# Altium project ECG.PrjPcb
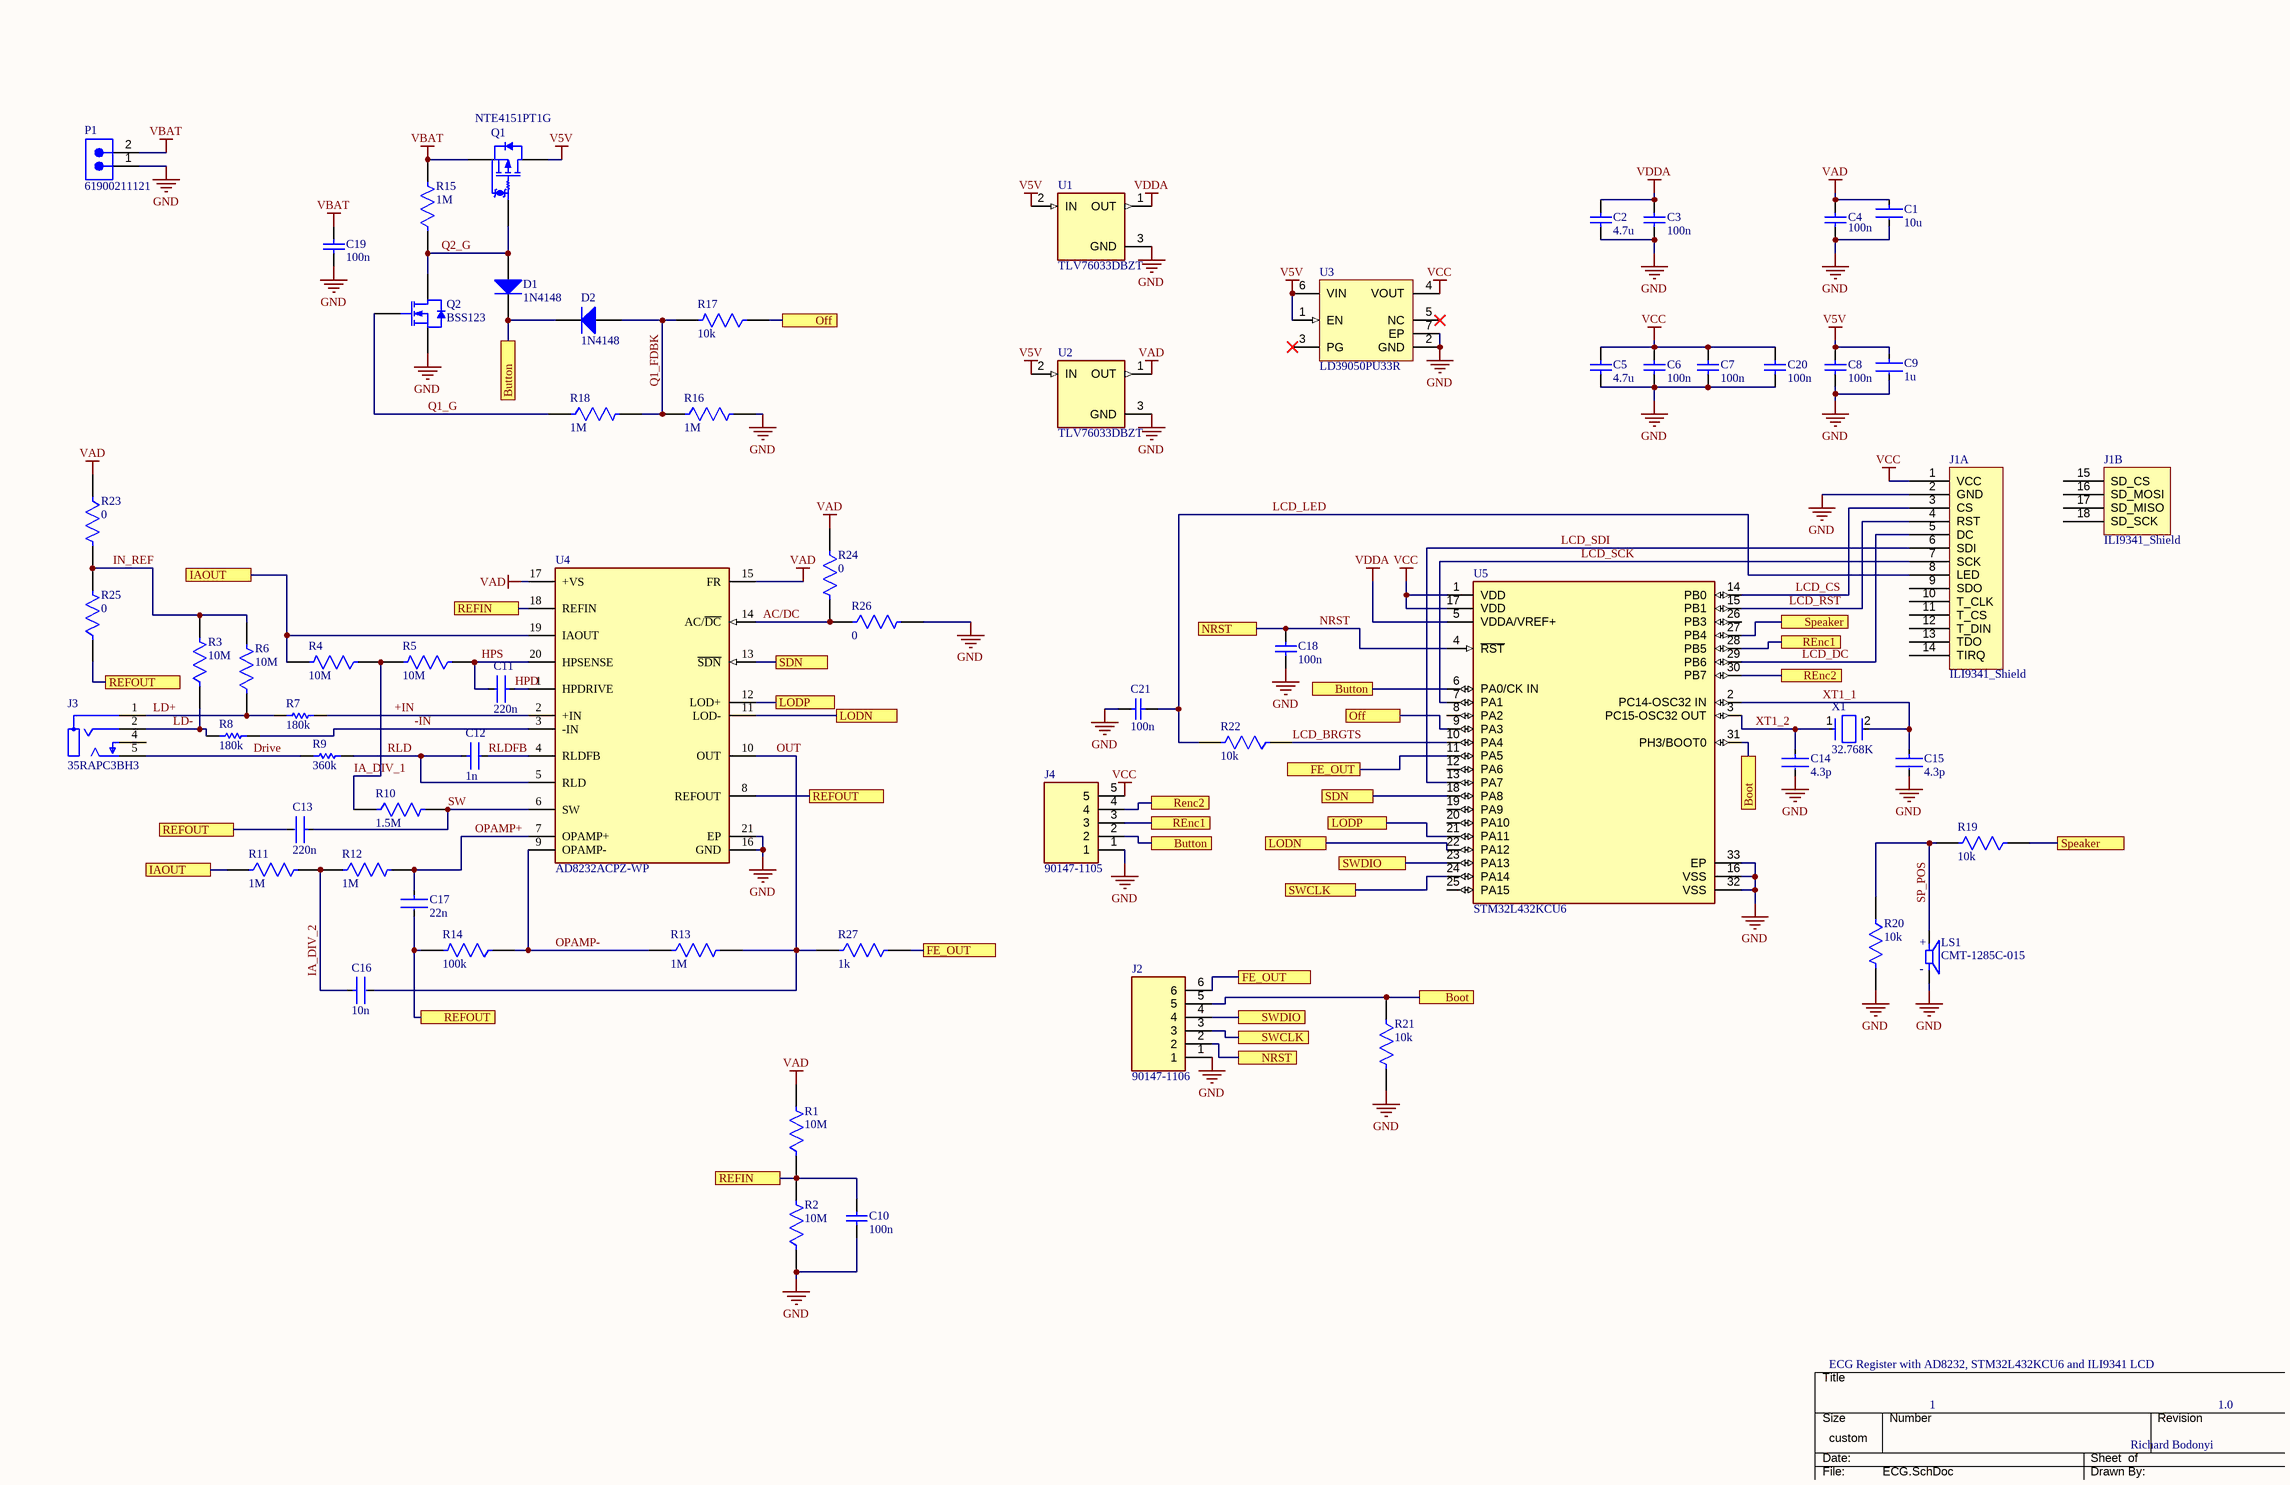
[diagram p0: ECG.SchDoc]
CAGE_CODE: ?????; CONTRACT_NUMBER: <CONTRACT NO>; DOC_NO_ASSY_DWG: <ASSY DWG NO>; DOC_NO_BOM: <BOM DOC NO>; DOC_NO_FAB_DWG: <FAB DWG NO>; DOC_NO_SCH_DWG: <SCH DWG NO>; PCB_2_DEC_TOL: +/-.01; PCB_3_DEC_TOL: +/-.010; PCB_ANG_TOL: +/-1/2; PCB_ASSEMBLY_NO: <PCB ASSY NO>; PCB_CHECKER: - -----; PCB_CHECKER_APP_DATE: --/--/----; PCB_DESIGNER: Richard Bodonyi; PCB_DESIGNER_APP_DATE: --/--/----; PCB_DWG_NO: <PCB DWG NO>; PCB_ENGINEER: Richard Bodonyi; PCB_ENGINEER_APP_DATE: --/--/----; PCB_PART_NUMBER: <PCB PN>; PCB_REV: A; SCH_REV: A
1 sheet, 64 parts. Net scope: flat (ports and power ports of the same name join across sheets).
Board file: ECG.PcbDoc

## Sheet ECG.SchDoc: ECG Register with AD8232, STM32L432KCU6 and ILI9341 LCD
size 431 x 279 mm; Date: 21/04/2024; Author: Richard Bodonyi; DrawnBy: Richard Bodonyi; Engineer: Richard Bodonyi; Revision: 1.0; SheetNumber: 1; SheetTotal: 1; Project: ECG Register; ENG_APP_DATE: --/--/--; DSN_APP_DATE: --/--/--; CHK_APP_DATE: --/--/--

### Parts
C1  10u  [FP-1206-L_3_2_0_2-W_1_6_0-IPC_B]
C2  4.7u  [CAPC1206(3216)190_N]
C3  100n  [CAPC1206(3216)100_N]
C4  100n  [CAPC1206(3216)100_N]
C5  4.7u  [CAPC1206(3216)190_N]
C6  100n  [CAPC1206(3216)100_N]
C7  100n  [CAPC1206(3216)100_N]
C8  100n  [CAPC1206(3216)100_N]
C9  1u  [FP-CL31-IPC_B]
C10  100n  [CAPC1206(3216)100_N]
C11  220n  [FP-CL31-IPC_B]
C12  1n  [FP-CL31-IPC_C]
C13  220n  [FP-CL31-IPC_B]
C14  4.3p  [FP-C1206C-EB-MFG]
C15  4.3p  [FP-C1206C-EB-MFG]
C16  10n  [FP-CL31-IPC_B]
C17  22n  [FP-CL31-IPC_B]
C18  100n  [CAPC1206(3216)100_N]
C19  100n  [CAPC1206(3216)100_N]
C20  100n  [CAPC1206(3216)100_N]
C21  100n  [CAPC1206(3216)100_N]
D1  1N4148  [DIOD-SOD123-2_V]
D2  1N4148  [DIOD-SOD123-2_V]
J1  ILI9341_Shield  [ILI9341_Shield-Footprint-1]  (parts A,B of 2)
J2  90147-1106  [RHDR6W64P0X254_1X6_1509X244X870P]
J3  35RAPC3BH3  [FP-35RAPC3BH3-MFG]
J4  90147-1105  [RHDR5W70P0X254_1X5_1255X244X870P]
LS1  CMT-1285C-015  [CUI_CMT-1285C-015]
P1  61900211121  [61900211121]
Q1  NTE4151PT1G  [ONSC-SC-89-3-463C-02_V]
Q2  BSS123  [FAIR-SOT23-3_V]
R1  10M  [FP-KTR18-IPC_B]
R2  10M  [FP-KTR18-IPC_B]
R3  10M  [FP-KTR18-IPC_B]
R4  10M  [FP-KTR18-IPC_B]
R5  10M  [FP-KTR18-IPC_B]
R6  10M  [FP-KTR18-IPC_B]
R7  180k  [RESC3216X70X40NL20T20]
R8  180k  [RESC3216X70X40NL20T20]
R9  360k  [RESC3216X60X45ML10T20]
R10  1.5M  [FP-KTR18-IPC_A]
R11  1M  [FP-KTR18-IPC_C]
R12  1M  [FP-KTR18-IPC_C]
R13  1M  [FP-KTR18-IPC_C]
R14  100k  [FP-KTR18-IPC_A]
R15  1M  [FP-KTR18-IPC_C]
R16  1M  [FP-KTR18-IPC_C]
R17  10k  [FP-CRCW1206-e3-IPC_C]
R18  1M  [FP-KTR18-IPC_C]
R19  10k  [FP-CRCW1206-e3-IPC_C]
R20  10k  [FP-CRCW1206-e3-IPC_C]
R21  10k  [FP-CRCW1206-e3-IPC_C]
R22  10k  [FP-CRCW1206-e3-IPC_C]
R23  0  [FP-CRCW1206-e3-IPC_C]
R24  0  [FP-CRCW1206-e3-IPC_C]
R25  0  [FP-CRCW1206-e3-IPC_C]
R26  0  [FP-CRCW1206-e3-IPC_C]
R27  1k  [FP-CRCW1206-e3-IPC_C]
U1  TLV76033DBZT  [FP-DBZ0003A-MFG]
U2  TLV76033DBZT  [FP-DBZ0003A-MFG]
U3  LD39050PU33R  [DFN6D_L]
U4  AD8232ACPZ-WP  [FP-CP-20-8-IPC_A]
U5  STM32L432KCU6  [FP-UFQFPN32-A0B8-MFG]
X1  32.768K  [FP-NX3215SA-MFG]

### Ports
Boot, Button, FE_OUT, IAOUT, LODN, LODP, NRST, Off, REFIN, REFOUT, REnc1, REnc2, Renc2, SDN, Speaker, SWCLK, SWDIO

### Nets
GND: C1.2 C2.1 C3.1 C4.1 C5.1 C6.1 C7.1 C8.1 C9.2 C10.1 C14.2 C15.2 C18.2 C19.1 C20.2 C21.1 J1.2(GND) J2.1 J4.1 LS1.N P1.1 Q2.2(S) R2.1 R16.2 R20.2 R21.2 R26.2 U1.3(GND) U2.3(GND) U3.2(GND) U3.7(EP) U4.16(GND) U4.21(EP) U5.16(VSS) U5.32(VSS) U5.33(EP)
V5V: C8.2 C9.1 Q1.3(D) U1.2(IN) U2.2(IN) U3.1(EN) U3.6(VIN)
VAD: C1.1 C4.2 R1.2 R23.1 R24.1 U2.1(OUT) U4.15(FR) U4.17(+VS)
VBAT: C19.2 P1.2 Q1.2(S) R15.2
VCC: C5.2 C6.2 C7.2 C20.1 J1.1(VCC) J4.5 U3.4(VOUT) U5.1(VDD) U5.17(VDD)
VDDA: C2.2 C3.2 U1.1(OUT) U5.5(VDDA/VREF+)
+IN: R7.2 U4.2(+IN)
-IN: R8.2 U4.3(-IN)
AC/DC: R24.2 R26.1 U4.14(AC/~{DC})
Boot: J2.5 R21.1 U5.31(PH3/BOOT0) ; port Boot
Button: D1.2(K) D2.2(K) J4.2 U5.6(PA0/CK_IN) ; port Button
Drive: J3.5 R9.1
FE_OUT: J2.6 R27.2 U5.11(PA5) ; port FE_OUT
HPD: C11.1 U4.1(HPDRIVE)
HPS: C11.2 R5.1 U4.20(HPSENSE)
IA_DIV_1: R4.1 R5.2 R10.1
IA_DIV_2: C16.1 R11.2 R12.1
IAOUT: R4.2 R11.1 U4.19(IAOUT) ; port IAOUT
IN_REF: R3.2 R6.2 R23.2 R25.2
LCD_BRGTS: R22.1 U5.10(PA4)
LCD_CS: J1.3(CS) U5.14(PB0)
LCD_DC: J1.5(DC) U5.29(PB6)
LCD_LED: C21.2 J1.8(LED) R22.2
LCD_RST: J1.4(RST) U5.15(PB1)
LCD_SCK: J1.7(SCK) U5.7(PA1)
LCD_SDI: J1.6(SDI) U5.13(PA7)
LD+: J3.1 R6.1 R7.1
LD-: J3.2 R3.1 R8.1
LODN: U4.11(LOD-) U5.22(PA12) ; port LODN
LODP: U4.12(LOD+) U5.21(PA11) ; port LODP
NRST: C18.1 J2.2 U5.4(~{RST}) ; port NRST
Off: R17.1 U5.9(PA3) ; port Off
OPAMP+: C17.1 R12.2 U4.7(OPAMP+)
OPAMP-: R13.1 R14.1 U4.9(OPAMP-)
OUT: C16.2 R13.2 R27.1 U4.10(OUT)
Q1_FDBK: D2.1(A) R16.1 R17.2 R18.2
Q1_G: Q2.1(G) R18.1
Q2_G: D1.1(A) Q1.1(G) Q2.3(D) R15.1
REFIN: C10.2 R1.1 R2.2 U4.18(REFIN) ; port REFIN
REFOUT: C13.2 C17.2 R14.2 R25.1 U4.8(REFOUT) ; port REFOUT
REnc1: J4.3 U5.28(PB5) ; port REnc1
REnc2: J4.4 U5.30(PB7) ; port REnc2, port Renc2
RLD: C12.1 R9.2 U4.5(RLD)
RLDFB: C12.2 U4.4(RLDFB)
SDN: U4.13(~{SDN}) U5.18(PA8) ; port SDN
SP_POS: LS1.P R19.2 R20.1
Speaker: R19.1 U5.27(PB4) ; port Speaker
SW: C13.1 R10.2 U4.6(SW)
SWCLK: J2.3 U5.24(PA14) ; port SWCLK
SWDIO: J2.4 U5.23(PA13) ; port SWDIO
XT1_1: C15.1 U5.2(PC14-OSC32_IN) X1.2
XT1_2: C14.1 U5.3(PC15-OSC32_OUT) X1.1

Not connected (* = marked no-connect by the designer): J1 9(SDO) 10(T_CLK) 11(T_CS) 12(T_DIN) 13(TDO) 14(TIRQ) 15(SD_CS) 16(SD_MOSI) 17(SD_MISO) 18(SD_SCK); J3 4; U3 3(PG)* 5(NC)*; U5 8(PA2) 12(PA6) 19(PA9) 20(PA10) 25(PA15) 26(PB3)

### Notes on the sheet
- 1
- DWG. NO.
- REV.
- SHT.
- THIS DOCUMENT AND THE DATA DISCLOSED HEREIN OR HEREWITH IS THE PROPERTY OF ALTIUM LIMITED AND MAY BE FREELY DISTRIBUTED IN WHOLE. NO RIGHTS ARE RESERVED OR EXPRESS OR IMPLIED WARANTEE GIVEN.
- REVISION
- DESCRIPTION
- DATE
- APPROVED
- ENG:
- APPROVALS
- PROJECT
- DSN:
- CHK:
- REFERENCE DOCUMENTS
- PROJECT REVISION:
- TITLE
- DOCUMENT REVISION:
- DESIGN ITEM:
- BOM:
- FAB DWG:
- PCB DWG:
- ASSY DWG:
- SCALE:
- SIZE
- B
- CAGE CODE
- FILE NAME
- DWG NO.
- SHEET
- OF
- REV
- (in symbol CMT-1285C-015) +; -

### Library data of the parts
C1 = CMP-04427-001599-1: General Purpose Ceramic Capacitor, 1206, 10uF, 20%, X5R, 15%, 50V
C2 C5 = CMP-1037-04896-1: CAP 4.7uF 6.3V ±10% 1206 (3216 Metric) Thickness 1.9mm SMD; Manufacturer Part Number: C1206C475K9PACTU; Case-Metric: 3216; Case-EIA: 1206; Tolerance: Â±10%; Value: 4.7uF; Max Thickness: 1.9 mm; Technology: SMT; Rated Voltage: 6.3 V
C3 C4 C6-C8 C10 C19 = CMP-1037-04190-1: CAP 100nF 25V ±5% 1206 (3216 Metric) Thickness 1mm SMD; Case-EIA: 1206; Tolerance: Â±5%; Case-Metric: 3216; Value: 100nF; Rated Voltage: 25 V; Technology: SMT; Max Thickness: 1 mm
C9 = CMP-13271-003701-1: Cap Ceramic 1uF 16V X7R ±10% SMD 1206 +125°C Embossed T/R; Mount: Surface Mount; Length: 0.126inch; Package Quantity: 1; Packaging: Tape and Reel; Max Operating Temperature: 125°C; Case/Package: 1206; Case Code (Metric): 3216; Tolerance: 10%; Min Operating Temperature: -55°C; Thickness: 0.055inch; Case Code (Imperial): 1206; Voltage Rating: 16V; Width: 0.063inch; Capacitance: 1uF
C11 C13 = CMP-13271-000776-1: Cap Ceramic 220nF 50V X7R ±10% SMD 1206 +125°C Embossed T/R; Length: 0.126inch; Case Code (Imperial): 1206; Package Quantity: 1; Case Code (Metric): 3216; Case/Package: 1206; Radiation Hardening: No; Min Operating Temperature: -55°C; Mount: Surface Mount; Max Operating Temperature: 125°C; Depth: 1.6mm; Tolerance: 10%; Capacitance: 220nF; Thickness: 0.055inch; Height: 1.25mm; Dielectric: X7R; Voltage Rating: 50V; Width: 0.063inch; Packaging: Tape and Reel
C12 = CMP-13271-001948-1: Cap Ceramic 1nF 50V X7R ±10% SMD 1206 +125°C Embossed T/R; Voltage: 63V; Case Code (Imperial): 1206; Depth: 1.6mm; Case Code (Metric): 3216; Width: 0.063inch; Package Quantity: 4000; Height: 0.85mm; Max Operating Temperature: 125°C; Radiation Hardening: No; Thickness: 0.037inch; Tolerance: 10%; Case/Package: 1206; Packaging: Tape and Reel; Voltage Rating (DC): 50V; Min Operating Temperature: -55°C; Material: Ceramic; Capacitance: 1nF; Length: 3.2mm; Voltage Rating: 50V; Mount: Surface Mount; Lead Free: Lead Free; Dielectric: X7R
C14 C15 = CMP-1037-00358-2: CAP CER 4.3PF 50V NP0 1206; Manufacturer: KEMET; Manufacturer Part Number: C1206C439C5GACTU; Tolerance: 0.25 pF; Automotive Grade: Grade 0; Temperature Characteristic: C0G; Material: Ceramic; Temperature Coefficient: 15%; Device Class L3: Ceramic Capacitors; Voltage Rating: 50 V; Capacitance: 4.3 pF; Octopart: https://octopart.com/c1206c439c5gactu-kemet-17002280; Lead Free: Yes; Category: Cap; Digikey Description: CAP CER 4.3PF 50V NP0 1206; Temperature: -55°C to +150°C; Package: C1206C-EB; Device Class L2: Capacitors; Value: 4.3 pF; ComponentLink2Description: Datasheet; Temperature Range Low: -55°C; Automotive: Yes; Mouser Description: Multilayer Ceramic Capacitors MLCC - SMD/SMT 50volts 4.3pF C0G 0.25%; Device Class L1: Passive Components; Temperature Range High: +150°C; Height: 0.88mm; Ipc Land Pattern Name: CAPC320160X78; RoHS: TRUE; ComponentLink2URL: https://content.kemet.com/datasheets/KEM_C1007_X8R_ULTRA_150C_SMD.pdf
C16 = CMP-13271-002682-1: Cap Ceramic 10nF 100V X7R ±5% SMD 1206 +125°C Embossed T/R; Case Code (Imperial): 1206; Case Code (Metric): 3216; Packaging: Tape and Reel; Tolerance: 5%; Length: 0.126inch; Case/Package: 1206; Thickness: 0.037inch; Voltage Rating: 100V; Mount: Surface Mount; Min Operating Temperature: -55°C; Capacitance: 10nF; Max Operating Temperature: 125°C; Width: 0.063inch; Package Quantity: 1
C17 = CMP-13271-001653-1: Cap Ceramic 22nF 630V X7R ±10% SMD 1206 +125°C Embossed T/R; Package Quantity: 1; Tolerance: 10%; Capacitance: 22nF; Min Operating Temperature: -55°C; Width: 0.063inch; Voltage Rating: 630V; Packaging: Tape and Reel; Case Code (Metric): 3216; Case/Package: 1206; Max Operating Temperature: 125°C; Thickness: 0.057inch; Lead Free: Lead Free; Length: 0.126inch; Case Code (Imperial): 1206; Mount: Surface Mount
C18 C20 C21 = CMP-1037-04190-1: CAP 100nF 25V ±5% 1206 (3216 Metric) Thickness 1mm SMD; Manufacturer Part Number: VJ1206Y104JXXCW1BC; Case-EIA: 1206; Tolerance: Â±5%; Case-Metric: 3216; Value: 100nF; Rated Voltage: 25 V; Technology: SMT; Max Thickness: 1 mm
D1 D2 = CMP-2000-04932-2: Fast Switching Diode, 100 V, 0.15 A, -65 to 150 degC, 2-Pin?SOD123, RoHS, Tape and Reel; Recovery Time: 4ns; Brand: DiodesIncorporated; Unit Weight: 0.000353oz; Max Surge Current: 2A; Peak Reverse Voltage: 100V; Ir - Reverse Current: 1uA; Vf - Forward Voltage: 1.25V; Configuration: Single; If - Forward Current: 0.15A; Product Category: Diodes-GeneralPurpose,Power,Switching; Operating Temperature Range: -65Cto+150C; Packaging: Reel; Manufacturer URL: http://www.diodes.com/; Maximum Operating Temperature: +150C; Height: 1.25mm; Minimum Operating Temperature: -65C; Product: SwitchingDiodes; Package URL: http://www.diodes.com/datasheets/ds18004.pdf; Type: SwitchingDiode; Package Reference: SOD123-2; Width: 1.7mm; Datasheet URL: http://www.farnell.com/datasheets/1915529.pdf; Datasheet Version: Rev. 24-2, 10/2013; Series: 1N4148; Factory Pack Quantity: 3000; Length: 2.85mm; RoHS: True; Manufacturer: DiodesIncorporated; Mounting Style: SMD/SMT; Package / Case: SOD-123
J1 = CMP-00000-11: ILI9341 LCD Shield
J2 = 90147-1106: Headers & Wire Housings VERT SINGLE PCB 6P straight tail; Manufacturer_Name: Molex; Geometry.Height: 8.7mm; Mouser Part Number: 538-90147-1106; Mouser Price/Stock: https://www.mouser.co.uk/ProductDetail/Molex/90147-1106?qs=zXrbR4Jv0OdcnWPUJ7rDTg%3D%3D; Manufacturer_Part_Number: 90147-1106; Datasheet Link: https://www.molex.com/pdm_docs/sd/901471215_sd.pdf
J3 = CMP-47983-000003-1: CONN JACK STEREO 3.5MM R/A; Gender: Female; Number of Positions: 3; Body Color: Black; Number of Ports: 1; Voltage Rating: 500V; Shielding: Unshielded; Body Material: Brass; Orientation: Right Angle; RoHS Compliant: Yes; Termination: Solder; Lead Free: Lead Free; Package Quantity: 1; Series: 35; Housing Material: PBT; Color: Black; Packaging: Bulk; Contact Plating: Silver; Mount: Through Hole; Contact Material: Copper Alloy; Number of Terminals/Pins: 3
J4 = 90147-1105: Headers & Wire Housings C-Grid PCB Conn SR V Conn SR Vt Tn-A 5Ckt; Manufacturer_Name: Molex; Geometry.Height: 8.7mm; Mouser Part Number: 538-90147-1105; Mouser Price/Stock: https://www.mouser.co.uk/ProductDetail/Molex/90147-1105?qs=QESXi79X%252BKok%2FrcE1h3Lyg%3D%3D; Manufacturer_Part_Number: 90147-1105; Datasheet Link: *
LS1 = CMT-1285C-015: 12 mm, 1.5 Vo-p, 91 dB, Through Hole, Magnetic Audio Transducer Buzzer; MF: CUI Devices; CUI_purchase_URL: https://www.cuidevices.com/product/audio/buzzers/audio-transducers/cmt-1285c-015?utm_source=snapeda.com&utm_medium=referral&utm_campaign=snapedaBOM; Price: None; Availability: Warning; SnapEDA_Link: https://www.snapeda.com/parts/CMT-1285C-015/CUI%20Devices/view-part/2772237/?ref=snap; Value: *; MP: CMT-1285C-015; Package: TO-220 CUI Inc.; Purchase-URL: https://pricing.snapeda.com/search/part/CMT-1285C-015/?ref=eda
P1 = CMP-1502-00584-3: NexarPartId: 18818218; Gender: Male; Connector Type: Male Pin; Insulation Resistance: 1GΩ; Contact Resistance: 20mΩ; Number of Contacts: 2; Operating Supply Voltage: 250V; Current Rating: 3A; Pitch: 2.54mm; Color: Beige; Fastening Type: Friction; Number of Pins: 2; Lead Pitch: 2.54mm; Orientation: Vertical; Max Operating Temperature: 105°C; Contact Mating Length: 7.493mm; RoHS: Compliant; Voltage Rating: 250V; Number of Positions: 2; Mount: Through Hole; Length: 5.08mm; Contact Plating: Tin; Width: 5.12mm; Termination: Through Hole; Flammability Rating: UL94 V-0; Min Operating Temperature: -40°C; Housing Material: Nylon; Contact Gender: Male; Number of Rows: 1; Packaging: Bulk; REACH SVHC: Unknown; Contact Material: Copper; Height: 11.75mm
Q1 = CMP-1058-00652-1: Small Signal MOSFET, -20 V, -760 mA, Single P-Channel, Gate Zener, 3-Pin SC-89, Pb-Free, Tape and Reel; Manufacturer: On Semiconductor; Channel Polarity: P Channel; Ciss Typ (pF): 156; Coss Typ (pF): 28; VGS(th) Max (V): 1.2; ID Max (A): 0.76; VGS Max (V): 6; V(BR)DSS Min (V): 20; Crss Typ (pF): 18; PartNumber: NTE4151PT1G; ComponentLink1URL: http://www.onsemi.com/; Mounting Technology: Surface Mount; Configuration: Single; ComponentLink3URL: http://www.onsemi.com/pub_link/Collateral/463C-02.PDF; ComponentLink3Description: Package Specification; ComponentLink1Description: Manufacturer URL; DatasheetVersion: Rev. 7; PackageVersion: Rev. C, 07/2003; ComponentLink2URL: http://www.onsemi.com/pub_link/Collateral/NTA4151P-D.PDF; RoHS: Pb-Free; PackageReference: SC-89-3-463C-02; Package Type: SC-89-3; PackageDescription: 3-Pin Small Outline Transistor, Body 1.6 x 0.85 mm, Pitch 0.5 mm; ComponentLink2Description: Datasheet; Packing: Tape and Reel
Q2 = CMP-2000-04934-1: N-Channel Logic Level Enhancement Mode Field Effect Transistor, 1.7 V, -55 to 150 degC, 3-Pin SOT-23, RoHS, Tape and Reel; Manufacturer: Fairchild; Channel Type: N; Typical Turn-Off Delay Time: 17ns; Maximum Continuous Drain Current: 0.17A; Rad Hard: No; Typical Rise Time: 9ns; Typical Fall Time: 2.4ns; Maximum Gate Source Voltage: ±20V; Maximum Drain Source Voltage: 100V; Typical Turn-On Delay Time: 1.7ns; RDS-on: 6000@10VmOhm; Package Version: Rev. 12, 03/2016; Packaging: Tape&Reel; Package Reference: SOT23-3; Channel Mode: Enhancement; Operating Temperature: -55to150degC; Package Description: 3-Pin Small Outline Transistor, Body 2.92 x 1.325 mm, Pitch 0.95 mm; Category: MOSFET; Datasheet Version: Jun-03; Datasheet URL: https://www.fairchildsemi.com/datasheets/BS/BSS123.pdf; Manufacturer URL: https://www.fairchildsemi.com/; Mounting: SurfaceMount; Package: 3SOT-23; Package URL: http://www.fairchildsemi.com/dwg/MA/MA03D.pdf
R1-R6 = CMP-08839-030218-1: Res Thick Film 1206 10MΩ 1% 0.1W ±100ppm/°C Automotive Paper T/R; Power Rating: 250mW; Resistance: 10MR; Package Quantity: 1; Case Code (Metric): 3216; Length: 0.126inch; Min Operating Temperature: -55°C; Series: KTR; Height: 0.026inch; Case/Package: 1206; Number of Terminations: 2; Mount: Surface Mount; Width: 0.063inch; Packaging: Tape and Reel; Lead Free: Lead Free; Case Code (Imperial): 1206; Max Power Dissipation: 250mW; Features: Automotive AEC-Q200; Resistor Type: Thick Film; Max Operating Temperature: 155°C; Tolerance: 1%; Temperature Coefficient: 100ppm/°C; RoHS Compliant: Yes
R7 R8 = CMP-2003-04559-1: Part Number: RK73B2BTTD184J; Manufacturer: KOA Speer
R9 = CMP-2003-02118-1: Part Number: CRCW1206360KJNEA; Manufacturer: Vishay Dale
R10 = CMP-08839-006825-1: Res Thick Film 1206 1.5MΩ 1% 0.1W ±100ppm/°C Automotive Paper T/R; Max Power Dissipation: 250mW; Resistance: 1.5MR; Features: Automotive AEC-Q200; Number of Terminations: 2; Package Quantity: 1; Temperature Coefficient: 100ppm/°C; Resistor Type: Thick Film; Tolerance: 1%; Width: 0.063inch; Length: 0.126inch; Series: KTR18; Case/Package: 1206; Case Code (Imperial): 1206; Min Operating Temperature: -55°C; RoHS Compliant: Yes; Packaging: Tape and Reel; Max Operating Temperature: 155°C; Case Code (Metric): 3216; Height: 0.026inch
R11-R13 R15 R16 R18 = CMP-08839-030004-1: Res Thick Film 1206 1MΩ 1% 0.1W ±100ppm/°C Automotive Paper T/R; Resistance: 1MR; Power Rating: 250mW; Package Quantity: 1; Mount: Surface Mount; Min Operating Temperature: -55°C; Case Code (Metric): 3216; Case Code (Imperial): 1206; Width: 0.063inch; Height: 0.026inch; Packaging: Tape and Reel; Max Operating Temperature: 155°C; Resistor Type: Thick Film; Features: Automotive AEC-Q200; Length: 0.126inch; RoHS Compliant: Yes; Tolerance: 1%; Temperature Coefficient: 100ppm/°C; Lead Free: Lead Free; Case/Package: 1206; Number of Terminations: 2; Series: KTR18; Max Power Dissipation: 250mW
R14 = CMP-08839-031298-1: Res Thick Film 1206 100kΩ 1% 0.1W ±100ppm/°C Automotive Paper T/R; Max Power Dissipation: 250mW; Resistance: 100kR; Temperature Coefficient: 100ppm/°C; Case Code (Metric): 3216; Features: Automotive AEC-Q200; Number of Terminations: 2; Max Operating Temperature: 155°C; Width: 0.063inch; Package Quantity: 1; Packaging: Tape and Reel; Case Code (Imperial): 1206; Resistor Type: Thick Film; Height: 0.026inch; Power Rating: 250mW; Length: 0.126inch; Mount: Surface Mount; Series: KTR; RoHS Compliant: Yes; Min Operating Temperature: -55°C; Case/Package: 1206; Tolerance: 1%; Lead Free: Lead Free
R17 R19-R27 = CMP-2003-04807-2: RES Thick Film, 10kΩ, 1%, 0.25W, 100ppm/°C, 1206; Working Voltage: 200V; Max Power Dissipation: 250mW; Resistance: 10kR; Tolerance: 1%; Width: 0.063inch; Height: 0.55mm; Number of Pins: 2; Voltage Rating: 200V; Temperature Coefficient: 100ppm/°C; Military Standard: Not; Features: Automotive AEC-Q200; Depth: 1.6mm; Radiation Hardening: No; Termination: SMD/SMT; Case Code (Imperial): 1206; Weight: 0.000353oz; Length: 3.2mm; Package Quantity: 10; Voltage Rating (DC): 200V; Case/Package: 1206; Min Operating Temperature: -55°C; Number of Terminations: 2; Composition: Thick Film; Contact Plating: Tin; Power Rating: 250mW; Packaging: Tape and Reel; Max Operating Temperature: 155°C; Lead Free: Lead Free; Case Code (Metric): 3216
U1 U2 = CMP-04917-000033-1: IC REG LINEAR 3.3V 100MA SOT23-3; Manufacturer: Texas Instruments; Max Supply Voltage: 30V; Standoff Height: 0.01mm; Accuracy Percentage: 4%; Nominal Supply Current: 2mA; Output Type: Fixed; Min Supply Voltage: 4.2V; Dropout Voltage: 0.9V; Number Of Outputs: 1; Max Junction Temp: +125°C; RoHS: TRUE; ComponentLink2Description: Datasheet; Manufacturer Part Number: TLV76033DBZT; Device Class L2: Power Management ICs; Temperature Range High: +125°C; Height: 1.12mm; Ipc Land Pattern Name: SOT95P237X112-3; Device Class L1: Integrated Circuits (ICs); Package: DBZ0003A; Output Voltage: 3.3V; Temperature: -40°C to +125°C; Device Class L3: Voltage Regulators - Linear; Lead Free: Yes; Output Current: 100mA; Temperature Range Low: -40°C; Digikey Description: IC REG LINEAR 3.3V 100MA SOT23-3; Automotive: No; Category: IC; ComponentLink2URL: http://www.ti.com/lit/ds/symlink/tlv760.pdf; Octopart: https://octopart.com/tlv76033dbzt-texas+instruments-84619834
U3 = CMP-0244-00288-1: 500 mA Low Quiescent Current Low Noise Voltage Regulator, 3.3V, 6-Pin VDFDPN, Tape and Reel; PackageReference: DFN6D; ComponentLink1Description: Manufacturer URL; ComponentLink1URL: http://www.st.com; PackageVersion: 2008; PackageDescription: 6-Pin Plastic, Dual LLP, 3 x 3 mm Body, 0.95 mm Pitch, Exposed Pad; ComponentLink2URL: http://www.st.com/internet/com/TECHNICAL_RESOURCES/TECHNICAL_LITERATURE/DATASHEET/CD00227527.pdf; DatasheetVersion: 1/03/2009; ComponentLink2Description: Datasheet; Manufacturer Part Number: LD39050PU33R
U4 = CMP-09085-000022-1: IC ECG FRONT END 20LFCSP; Number of Channels: 1; Input Offset Voltage (Vos): 3mV; Slew Rate: 0.2V/µs; Min Supply Voltage: 2V; Power Supply Rejection Ratio (PSRR): 90dB; Max Supply Voltage: 3.5V; Input Bias Current: 200pA; Operating Supply Current: 170uA; Common Mode Rejection Ratio: 80dB; Gain Bandwidth Product: 100kHz; Packaging: Tray; RoHS Compliant: Yes; Radiation Hardening: No; Contact Plating: Tin; Number of Pins: 20; Width: 4.1mm; REACH SVHC: No SVHC; Mount: Surface Mount; Length: 4.1mm; Lead Free: Contains Lead; Case/Package: LFCSP EP; Min Operating Temperature: -40°C; Max Operating Temperature: 85°C; Height: 0.75mm; Series: -
U5 = CMP-12105-000033-1: IC MCU 32BIT 256KB FLASH 32QFPN; Manufacturer: STMicroelectronics; Manufacturer Part Number 1: STM32L432KCU3; Max Supply Voltage: 3.6V; Number Of Timers/Counters: 11; Ram Size: 64KBytes; Number Of Usb Channels: 1; Memory Size: 256KBytes; Number Of Uart Channels: 3; Frequency: 80MHz; Number Of I2C Channels: 2; Core Architecture: ARM Cortex-M4; Number Of I/Os: 26; Min Supply Voltage: 1.62V; Data Bus Width: 32bits; Max Junction Temp: +105°C; Interface: I2C,SPI,UART,USART,CAN,USB,LIN,IrDA,Other; Ambient Temperature Range High: +85°C; Category: IC; Device Class L2: Embedded Processors and Controllers; Ambient Temperature Range Low: -40°C; Number Of Adc Channels: 11; ComponentLink2Description: Datasheet; Number Of A/D Converters: 1; Device Class L1: Integrated Circuits (ICs); Memory Type: FLASH; Height: 0.6mm; Temperature: -40°C to +105°C; Automotive: No; Temperature Range Low: -40°C; Digikey Description: IC MCU 32BIT 256KB FLASH 32QFPN; Manufacturer Part Number: STM32L432KCU6; Temperature Range High: +105°C; Octopart: https://octopart.com/stm32l432kcu6-stmicroelectronics-71093510; Device Class L3: Microcontrollers; Number Of Pwm Channels: 1; Number Of Spi Channels: 2; Lead Free: Yes; Number Of Cores: 1; Package: UFQFPN32-A0B8; ComponentLink2URL: https://www.st.com/content/ccc/resource/technical/document/datasheet/24/01/9f/59/f0/83/47/fc/DM00257205.pdf/files/DM00257205.pdf/jcr:content/translations/en.DM00257205.pdf; RoHS: TRUE
X1 = CMP-200220-000010-1: CRYSTAL 32.7680KHZ 12.5PF SMD; Frequency: 32.768kHz; ESR (Equivalent Series Resistance): 70kR; Frequency Tolerance: 20ppm; Load Capacitance: 12.5pF; Case/Package: SMD/SMT; Packaging: Tape and Reel; Max Operating Temperature: 125°C; Mount: Surface Mount; Min Operating Temperature: -40°C; Length: 0.126inch; Number of Pins: 2; Width: 0.059inch; Height: 0.035inch; Package Quantity: 1000

## Assembly variants
ECG_1: all parts fitted